# EAGLE schematic NSE2020_1 (EAGLE 9.4.2)
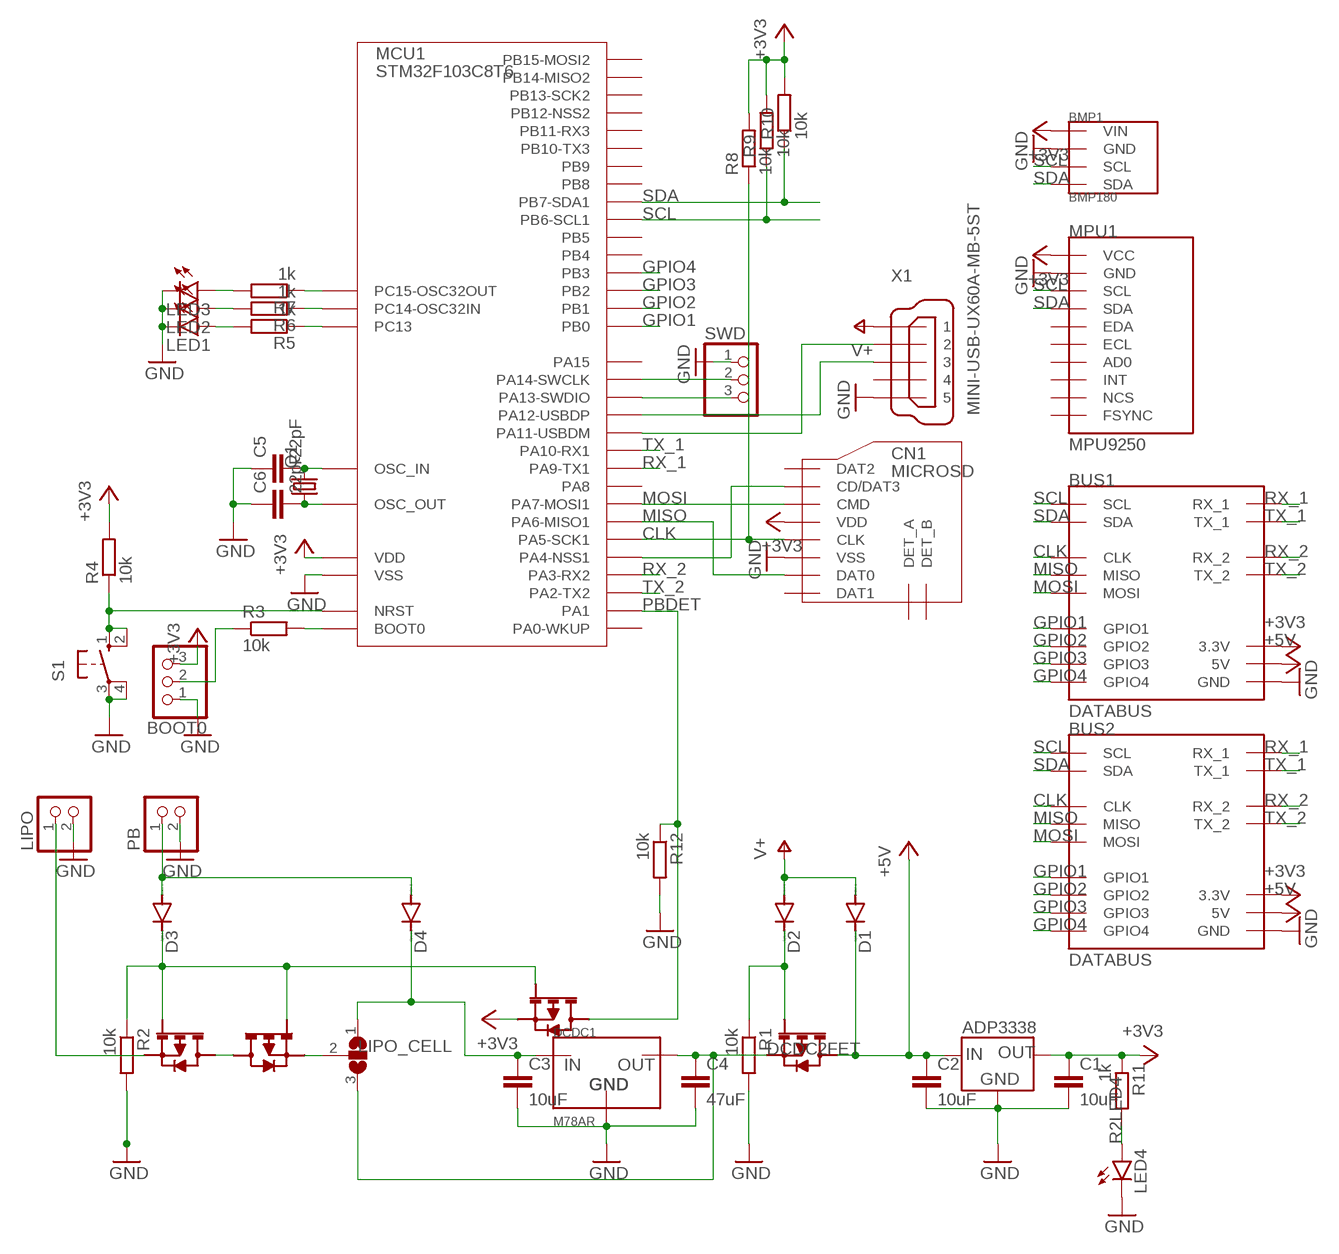
[diagram p0: schematic, sheet 1]

## Parts
BMP1  BMP180  [GY-68]
BOOT0  PINHD-1X3  [1X03]
BUS1  DATABUS  [8X2]
BUS2  DATABUS  [8X2]
C1  10uF  C-EUC2012  [C2012]
C2  10uF  C-EUC2012  [C2012]
C3  10uF  C-EUC2012  [C2012]
C4  47uF  C-EUC2012  [C2012]
C5  22pF  C-EUC2012  [C2012]
C6  22pF  C-EUC2012  [C2012]
CN1  MICROSD  [DM3AT]
D1  DIODE-SOD123  [SOD123]
D2  DIODE-SOD123  [SOD123]
D3  DIODE-SOD123  [SOD123]
D4  DIODE-SOD123  [SOD123]
DCDC1  M78AR  [M78AR]
IC1  ADP3338-3.3  [SOT-223]
LED1  LEDSMT1206  [1206]
LED2  LEDSMT1206  [1206]
LED3  LEDSMT1206  [1206]
LED4  LEDSMT1206  [1206]
LIPO  PINHD-1X2  [1X02]
LIPO_CELL  SJ2W  [SJ_2]
MCU1  STM32F103C8T6  [LQFP48]
MPU1  MPU9250  [GY-9250]
PB  PINHD-1X2  [1X02]
Q1  CRYSTALHC49S  [HC49/S]
R1  10k  R-EU_M2012  [M2012]
R2  10k  R-EU_M2012  [M2012]
R3  10k  R-EU_M2012  [M2012]
R4  10k  R-EU_M2012  [M2012]
R5  1k  R-EU_M2012  [M2012]
R6  1k  R-EU_M2012  [M2012]
R7  1k  R-EU_M2012  [M2012]
R8  10k  R-EU_M2012  [M2012]
R9  10k  R-EU_M2012  [M2012]
R10  10k  R-EU_M2012  [M2012]
R11  1k  R-EU_M2012  [M2012]
R12  10k  R-EU_M2012  [M2012]
S1  10-XX  [B3F-10XX]
SWD  PINHD-1X3  [1X03]
U$1  2SJ681  [2SJ681]
U$2  2SJ681  [2SJ681]
U$3  2SJ681  [2SJ681]
U$4  2SJ681  [2SJ681]
X1  MINI-USB-UX60A-MB-5ST  [UX60A-MB-5ST]

## Nets
+3V3 [PWR_L]: BMP1.P1(VIN) BOOT0.3 BUS1.P6(3.3V) BUS2.P6(3.3V) C1.1 CN1.VDD IC1.1(OUT) IC1.2(OUT) MCU1.1(VDD) MCU1.9(VDD) MCU1.24(VDD) MCU1.36(VDD) MCU1.48(VDD) MPU1.P1(VCC) R4.2 R8.2 R9.2 R10.2 R11.1 U$4.P$3
+5V [PWR_H]: BUS1.P7(5V) BUS2.P7(5V) C2.1 D1.C IC1.3(IN) U$1.P$2 U$1.P$4
BAT2DCDC [PWR_H]: C3.1 D4.C DCDC1.P1(IN) LIPO_CELL.1
BOOT0 [SIGNAL]: BOOT0.2 R3.1
BOOT0_R [SIGNAL]: MCU1.44(BOOT0) R3.2
CLK [SIGNAL]: BUS1.P1(CLK) BUS2.P1(CLK) CN1.CLK MCU1.15(PA5-SCK1) R8.1
CRYIN [IO]: C5.2 MCU1.5(OSC_IN) Q1.2
CRYOUT [IO]: C6.2 MCU1.6(OSC_OUT) Q1.1
CS_SD [SIGNAL]: CN1.CD/DAT3 MCU1.14(PA4-NSS1)
DCDC2FET [PWR_H]: C4.1 DCDC1.P3(OUT) LIPO_CELL.3 U$1.P$3
DM [SIGNAL]: MCU1.32(PA11-USBDM) X1.2
DP [SIGNAL]: MCU1.33(PA12-USBDP) X1.3
FET2JUMP [PWR_H]: LIPO_CELL.2 U$2.P$3
GND [GND]: BMP1.P2(GND) BOOT0.1 BUS1.P11(GND) BUS2.P11(GND) C1.2 C2.2 C3.2 C4.2 C5.1 C6.1 CN1.VSS DCDC1.P2(GND) IC1.4(GND) LED1.C LED2.C LED3.C LED4.C LIPO.2 MCU1.8(VSS) MCU1.23(VSS) MCU1.35(VSS) MCU1.47(VSS) MPU1.P10(GND) PB.2 R1.2 R2.2 R12.2 S1.3(P) S1.4(P1) SWD.1 X1.5
GPIO1 [SIGNAL]: BUS1.P3(GPIO1) BUS2.P3(GPIO1) MCU1.18(PB0)
GPIO2 [SIGNAL]: BUS1.P10(GPIO2) BUS2.P10(GPIO2) MCU1.19(PB1)
GPIO3 [SIGNAL]: BUS1.P14(GPIO3) BUS2.P14(GPIO3) MCU1.20(PB2)
GPIO4 [SIGNAL]: BUS1.P15(GPIO4) BUS2.P15(GPIO4) MCU1.39(PB3)
IO2LED1 [IO]: MCU1.2(PC13) R5.1
IO2R2 [IO]: MCU1.3(PC14-OSC32IN) R6.1
IO2R3 [IO]: MCU1.4(PC15-OSC32OUT) R7.1
LIPO_FET2FET [PWR_H]: U$2.P$2 U$2.P$4 U$3.P$2 U$3.P$4
LIPOIN [PWR_H]: LIPO.1 U$3.P$3
MISO [SIGNAL]: BUS1.P12(MISO) BUS2.P12(MISO) CN1.DAT0 MCU1.16(PA6-MISO1)
MOSI [SIGNAL]: BUS1.P2(MOSI) BUS2.P2(MOSI) CN1.CMD MCU1.17(PA7-MOSI1)
NRST [SIGNAL]: MCU1.7(NRST) R4.1 S1.1(S) S1.2(S1)
PBDET [SIGNAL]: MCU1.11(PA1) R12.1 U$4.P$2 U$4.P$4
PBGATE [SIGNAL]: D3.C R2.1 U$2.P$1 U$3.P$1 U$4.P$1
PBIN [PWR_H]: D3.A D4.A PB.1
R2LED1 [IO]: LED1.A R5.2
R2LED2 [IO]: LED2.A R6.2
R2LED3 [IO]: LED3.A R7.2
R2LED4 [PWR_L]: LED4.A R11.2
RX_1 [SIGNAL]: BUS1.P4(RX_1) BUS2.P4(RX_1) MCU1.30(PA9-TX1)
RX_2 [SIGNAL]: BUS1.P9(RX_2) BUS2.P9(RX_2) MCU1.13(PA3-RX2)
SCL [SIGNAL]: BMP1.P3(SCL) BUS1.P0(SCL) BUS2.P0(SCL) MCU1.42(PB6-SCL1) MPU1.P3(SCL) R9.1
SDA [SIGNAL]: BMP1.P4(SDA) BUS1.P13(SDA) BUS2.P13(SDA) MCU1.43(PB7-SDA1) MPU1.P4(SDA) R10.1
SWCLK [SIGNAL]: MCU1.37(PA14-SWCLK) SWD.2
SWDIO [SIGNAL]: MCU1.34(PA13-SWDIO) SWD.3
TX_1 [SIGNAL]: BUS1.P5(TX_1) BUS2.P5(TX_1) MCU1.31(PA10-RX1)
TX_2 [SIGNAL]: BUS1.P8(TX_2) BUS2.P8(TX_2) MCU1.12(PA2-TX2)
USBGATE [SIGNAL]: D2.C R1.1 U$1.P$1
V+ [PWR_H]: D1.A D2.A X1.1
Unconnected: CN1.DAT1 CN1.DAT2 CN1.DET_A CN1.DET_B MCU1.10(PA0-WKUP) MCU1.21(PB10-TX3) MCU1.22(PB11-RX3) MCU1.25(PB12-NSS2) MCU1.26(PB13-SCK2) MCU1.27(PB14-MISO2) MCU1.28(PB15-MOSI2) MCU1.29(PA8) MCU1.38(PA15) MCU1.40(PB4) MCU1.41(PB5) MCU1.45(PB8) MCU1.46(PB9) MPU1.P2(AD0) MPU1.P5(ECL) MPU1.P6(EDA) MPU1.P7(FSYNC) MPU1.P8(INT) MPU1.P9(NCS) X1.4

## Library data of the parts
BMP1 = BMP180:BMP180
BOOT0 SWD = pinhead:PINHD-1X3: PIN HEADER
BUS1 BUS2 = databus:DATABUS
C1-C6 = rcl:C-EU: CAPACITOR, European symbol; SPICEPREFIX: C
CN1 = microSD:MICROSD
D1-D4 = diode:DIODE-: DIODE
DCDC1 = M78AR:M78AR
IC1 = ADP3338:ADP3338-3.3
LED1-LED4 = led:LED: LED OSRAM: - CHIPLED LG R971, LG N971, LY N971, LG Q971, LY Q971, LO R971, LY R971 LH N974, LH R974 LS Q976, LO Q976, LY Q976 LO Q996 - Hyper CHIPLED LW Q18S LB Q993, LB Q99A, LB R99A - SideLED LS A670, LO A670, LY A670, LG A670, LP A670 LB A673, LV A673, LT A673, LW A673 LH A674 LY A675 LS A676, LA A676, LO A676, LY A676, LW A676 LS A679, LY A679, LG A679 - Hyper Micro SIDELED® LS Y876, LA Y876, LO Y876, LY Y876 LT Y87S - SmartLED LW L88C, LW L88S LB L89C, LB L89S, LG L890 LS L89K, LO L89K, LY L89K LS L896, LA L896, LO L896, LY L896 - TOPLED LS T670, LO T670, LY T670, LG T670, LP T670 LSG T670, LSP T670, LSY T670, LOP T670, LYG T670 LG T671, LOG T671, LSG T671 LB T673, LV T673, LT T673, LW T673 LH T674 LS T676, LA T676, LO T676, LY T676, LB T676, LH T676, LSB T676, LW T676 LB T67C, LV T67C, LT T67C, LS T67K, LO T67K, LY T67K, LW E67C LS E67B, LA E67B, LO E67B, LY E67B, LB E67C, LV E67C, LT E67C LW T67C LS T679, LY T679, LG T679 LS T770, LO T770, LY T770, LG T770, LP T770 LB T773, LV T773, LT T773, LW T773 LH T774 LS E675, LA E675, LY E675, LS T675 LS T776, LA T776, LO T776, LY T776, LB T776 LHGB T686 LT T68C, LB T68C - Hyper Mini TOPLED® LB M676 - Mini TOPLED Santana® LG M470 LS M47K, LO M47K, LY M47K Source: http://www.osram.convergy.de LUXEON: - LUMILED® LXK2-PW12-R00, LXK2-PW12-S00, LXK2-PW14-U00, LXK2-PW14-V00 LXK2-PM12-R00, LXK2-PM12-S00, LXK2-PM14-U00 LXK2-PE12-Q00, LXK2-PE12-R00, LXK2-PE12-S00, LXK2-PE14-T00, LXK2-PE14-U00 LXK2-PB12-K00, LXK2-PB12-L00, LXK2-PB12-M00, LXK2-PB14-N00, LXK2-PB14-P00, LXK2-PB14-Q00 LXK2-PR12-L00, LXK2-PR12-M00, LXK2-PR14-Q00, LXK2-PR14-R00 LXK2-PD12-Q00, LXK2-PD12-R00, LXK2-PD12-S00 LXK2-PH12-R00, LXK2-PH12-S00 LXK2-PL12-P00, LXK2-PL12-Q00, LXK2-PL12-R00 Source: www.luxeon.com KINGBRIGHT: KA-3528ASYC Source: www.kingbright.com
LIPO PB = pinhead:PINHD-1X2: PIN HEADER
LIPO_CELL = jumper:SJ2W: SMD solder JUMPER
MCU1 = STM32F103C8T6:STM32F103C8T6
MPU1 = MPU9250:MPU9250
Q1 = crystal:CRYSTAL: CRYSTAL; OC_FARNELL: 1667008; OC_NEWARK: unknown
R1-R12 = rcl:R-EU_: RESISTOR, European symbol; SPICEPREFIX: R
S1 = switch-omron:10-XX: OMRON SWITCH; MPN: B3F-1000; OC_FARNELL: 176432; OC_NEWARK: 36M3542
U$1-U$4 = 2SJ681:2SJ681
X1 = con-hirose:MINI-USB-: MINI USB Connector Source: http://www.hirose.co.jp/cataloge_hp/e24000019.pdf; OC_FARNELL: unknown; OC_NEWARK: unknown

## Net classes
1 SIGNAL: width 0.152 mm, drill 0.305 mm, clearance 0.152 mm
2 PWR_H: width 0.635 mm, drill 0.305 mm, clearance 0.152 mm
3 PWR_L: width 0.381 mm, drill 0.305 mm, clearance 0.152 mm
4 GND: width 0.305 mm, drill 0.305 mm, clearance 0.152 mm
5 IO: width 0.305 mm, drill 0.305 mm, clearance 0.152 mm